# EAGLE design 002-main (EAGLE 9.6.2)

## Sheet 1 of 3
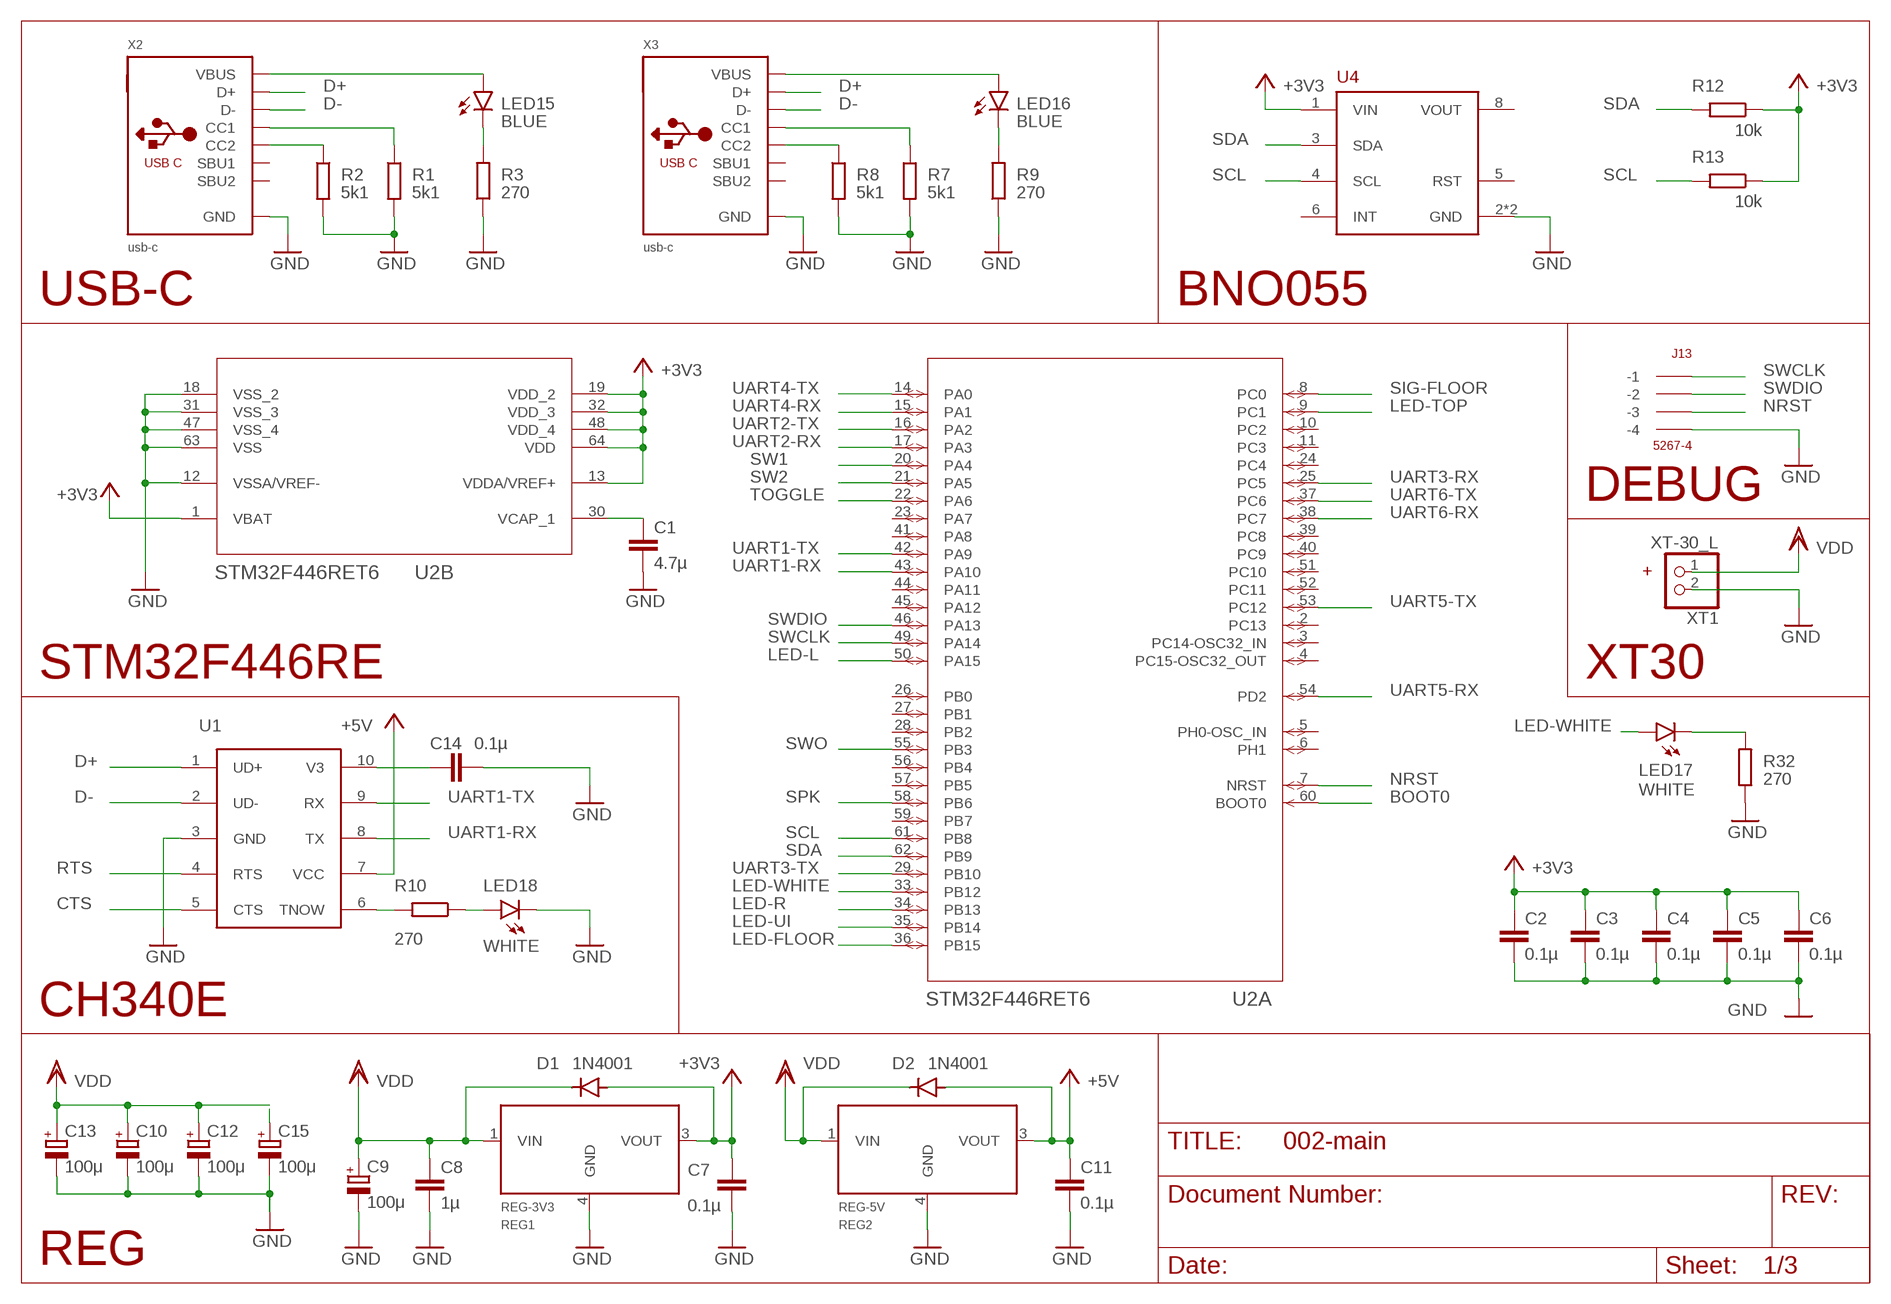
[diagram p0: schematic, sheet 1]

### Parts
C1  4.7µ  C-EUC0603  [C0603]
C2  0.1µ  C-EUC0603  [C0603]
C3  0.1µ  C-EUC0603  [C0603]
C4  0.1µ  C-EUC0603  [C0603]
C5  0.1µ  C-EUC0603  [C0603]
C6  0.1µ  C-EUC0603  [C0603]
C7  0.1µ  C-EUC0603  [C0603]
C8  1µ  C-EUC0603  [C0603]
C9  100μ  CPOL-EU153CLV-0505  [153CLV-0505]
C10  100μ  CPOL-EU153CLV-0505  [153CLV-0505]
C11  0.1µ  C-EUC0603  [C0603]
C12  100μ  CPOL-EU153CLV-0505  [153CLV-0505]
C13  100μ  CPOL-EU153CLV-0505  [153CLV-0505]
C14  0.1µ  C-EUC0603  [C0603]
C15  100μ  CPOL-EU153CLV-0505  [153CLV-0505]
D1  1N4001  GF1  [SMA-DO214AC]
D2  1N4001  GF1  [SMA-DO214AC]
J13  5267-4  [5267-4]
LED15  BLUE  LEDSML0603  [SML0603]
LED16  BLUE  LEDSML0603  [SML0603]
LED17  WHITE  LEDSML0603  [SML0603]
LED18  WHITE  LEDSML0603  [SML0603]
R1  5k1  R-EU_R0402  [R0402]
R2  5k1  R-EU_R0402  [R0402]
R3  270  R-EU_R0402  [R0402]
R7  5k1  R-EU_R0402  [R0402]
R8  5k1  R-EU_R0402  [R0402]
R9  270  R-EU_R0402  [R0402]
R10  270  R-EU_R0402  [R0402]
R12  10k  R-EU_R0402  [R0402]
R13  10k  R-EU_R0402  [R0402]
R32  270  R-EU_R0402  [R0402]
REG1  REG-3V3  MYPARTS_NJM7800S-REGULATOR  [MYPARTS_D-PAK_TO252AA]
REG2  REG-5V  MYPARTS_NJM7800S-REGULATOR  [MYPARTS_D-PAK_TO252AA]
U1  CH340ESMD  [MSOP10]
U2  STM32F446RET6  [LQFP64-10X10MM]
U4  BNO055  [SOCKET-08]
X2  usb-c  USB_C  [USB_C_CUSB31-CFM2AX-01-X]
X3  usb-c  USB_C  [USB_C_CUSB31-CFM2AX-01-X]
XT1  XT-30_L  [XT-30_L]

### Nets
+3V3: C2.1 C3.1 C4.1 C5.1 C6.1 C7.1 D1.A R12.1 R13.1 REG1.3(VOUT) U2.1(B:VBAT) U2.13(B:VDDA/VREF+) U2.19(B:VDD_2) U2.32(B:VDD_3) U2.48(B:VDD_4) U2.64(B:VDD) U4.1(VIN) ; also sheet 2,3
+5V: C11.1 D2.A REG2.3(VOUT) U1.7(VCC) ; also sheet 2,3
BOOT0: U2.60(A:BOOT0) ; also sheet 3
CTS: U1.5(CTS)
D+: U1.1(UD+) X2.A6(D+) X2.B6(D+) X3.A6(D+) X3.B6(D+)
D-: U1.2(UD-) X2.A7(D-) X2.B7(D-) X3.A7(D-) X3.B7(D-)
GND: C1.2 C2.2 C3.2 C4.2 C5.2 C6.2 C7.2 C8.2 C9.- C10.- C11.2 C12.- C13.- C14.2 C15.- J13.P$4(-4) LED18.C R1.2 R2.2 R3.1 R7.2 R8.2 R9.1 R32.1 REG1.4(GND) REG2.4(GND) U1.3(GND) U2.12(B:VSSA/VREF-) U2.18(B:VSS_2) U2.31(B:VSS_3) U2.47(B:VSS_4) U2.63(B:VSS) U4.2(GND) U4.7(GND) X2.A1B12(GND) X2.B1A12(GND) X3.A1B12(GND) X3.B1A12(GND) XT1.2 ; also sheet 2,3
LED-FLOOR: U2.36(A:PB15) ; also sheet 3
LED-L: U2.50(A:PA15) ; also sheet 2
LED-R: U2.34(A:PB13) ; also sheet 2
LED-TOP: U2.9(A:PC1) ; also sheet 2
LED-UI: U2.35(A:PB14) ; also sheet 3
LED-WHITE: LED17.A U2.33(A:PB12)
N$8: C14.1 U1.10(V3)
N$14: R1.1 X2.A5(CC1)
N$15: R2.1 X2.B5(CC2)
N$16: LED15.C R3.2
N$18: C1.1 U2.30(B:VCAP_1)
N$22: R10.2 U1.6(TNOW)
N$23: LED18.A R10.1
N$32: LED17.C R32.2
N$47: R7.1 X3.A5(CC1)
N$48: R8.1 X3.B5(CC2)
N$49: LED15.A X2.A4B9(VBUS) X2.B4A9(VBUS)
N$50: LED16.A X3.A4B9(VBUS) X3.B4A9(VBUS)
N$51: LED16.C R9.2
NRST: J13.P$3(-3) U2.7(A:NRST) ; also sheet 3
RTS: U1.4(RTS)
SCL: R13.2 U2.61(A:PB8) U4.4(SCL)
SDA: R12.2 U2.62(A:PB9) U4.3(SDA)
SIG-FLOOR: U2.8(A:PC0) ; also sheet 3
SPK: U2.58(A:PB6) ; also sheet 3
SW1: U2.20(A:PA4) ; also sheet 3
SW2: U2.21(A:PA5) ; also sheet 3
SWCLK: J13.P$1(-1) U2.49(A:PA14)
SWDIO: J13.P$2(-2) U2.46(A:PA13)
SWO: U2.55(A:PB3)
TOGGLE: U2.22(A:PA6) ; also sheet 3
UART1-RX: U1.8(TX) U2.43(A:PA10)
UART1-TX: U1.9(RX) U2.42(A:PA9)
UART2-RX: U2.17(A:PA3) ; also sheet 2
UART2-TX: U2.16(A:PA2) ; also sheet 2
UART3-RX: U2.25(A:PC5) ; also sheet 3
UART3-TX: U2.29(A:PB10) ; also sheet 3
UART4-RX: U2.15(A:PA1) ; also sheet 2
UART4-TX: U2.14(A:PA0) ; also sheet 2
UART5-RX: U2.54(A:PD2) ; also sheet 2
UART5-TX: U2.53(A:PC12) ; also sheet 2
UART6-RX: U2.38(A:PC7) ; also sheet 2
UART6-TX: U2.37(A:PC6) ; also sheet 2
VDD: C8.1 C9.+ C10.+ C12.+ C13.+ C15.+ D1.K(C) D2.K(C) REG1.1(VIN) REG2.1(VIN) XT1.1 ; also sheet 2
Unconnected: U2.2(A:PC13) U2.3(A:PC14-OSC32_IN) U2.4(A:PC15-OSC32_OUT) U2.5(A:PH0-OSC_IN) U2.6(A:PH1) U2.10(A:PC2) U2.11(A:PC3) U2.23(A:PA7) U2.24(A:PC4) U2.26(A:PB0) U2.27(A:PB1) U2.28(A:PB2) U2.39(A:PC8) U2.40(A:PC9) U2.41(A:PA8) U2.44(A:PA11) U2.45(A:PA12) U2.51(A:PC10) U2.52(A:PC11) U2.56(A:PB4) U2.57(A:PB5) U2.59(A:PB7) U4.5(RST) U4.6(INT) X2.A8(SBU1) X2.B8(SBU2) X3.A8(SBU1) X3.B8(SBU2)

### Notes on the sheet
- USB-C | BNO055
- DEBUG
- STM32F446RE | XT30
- CH340E
- REG

## Sheet 2 of 3
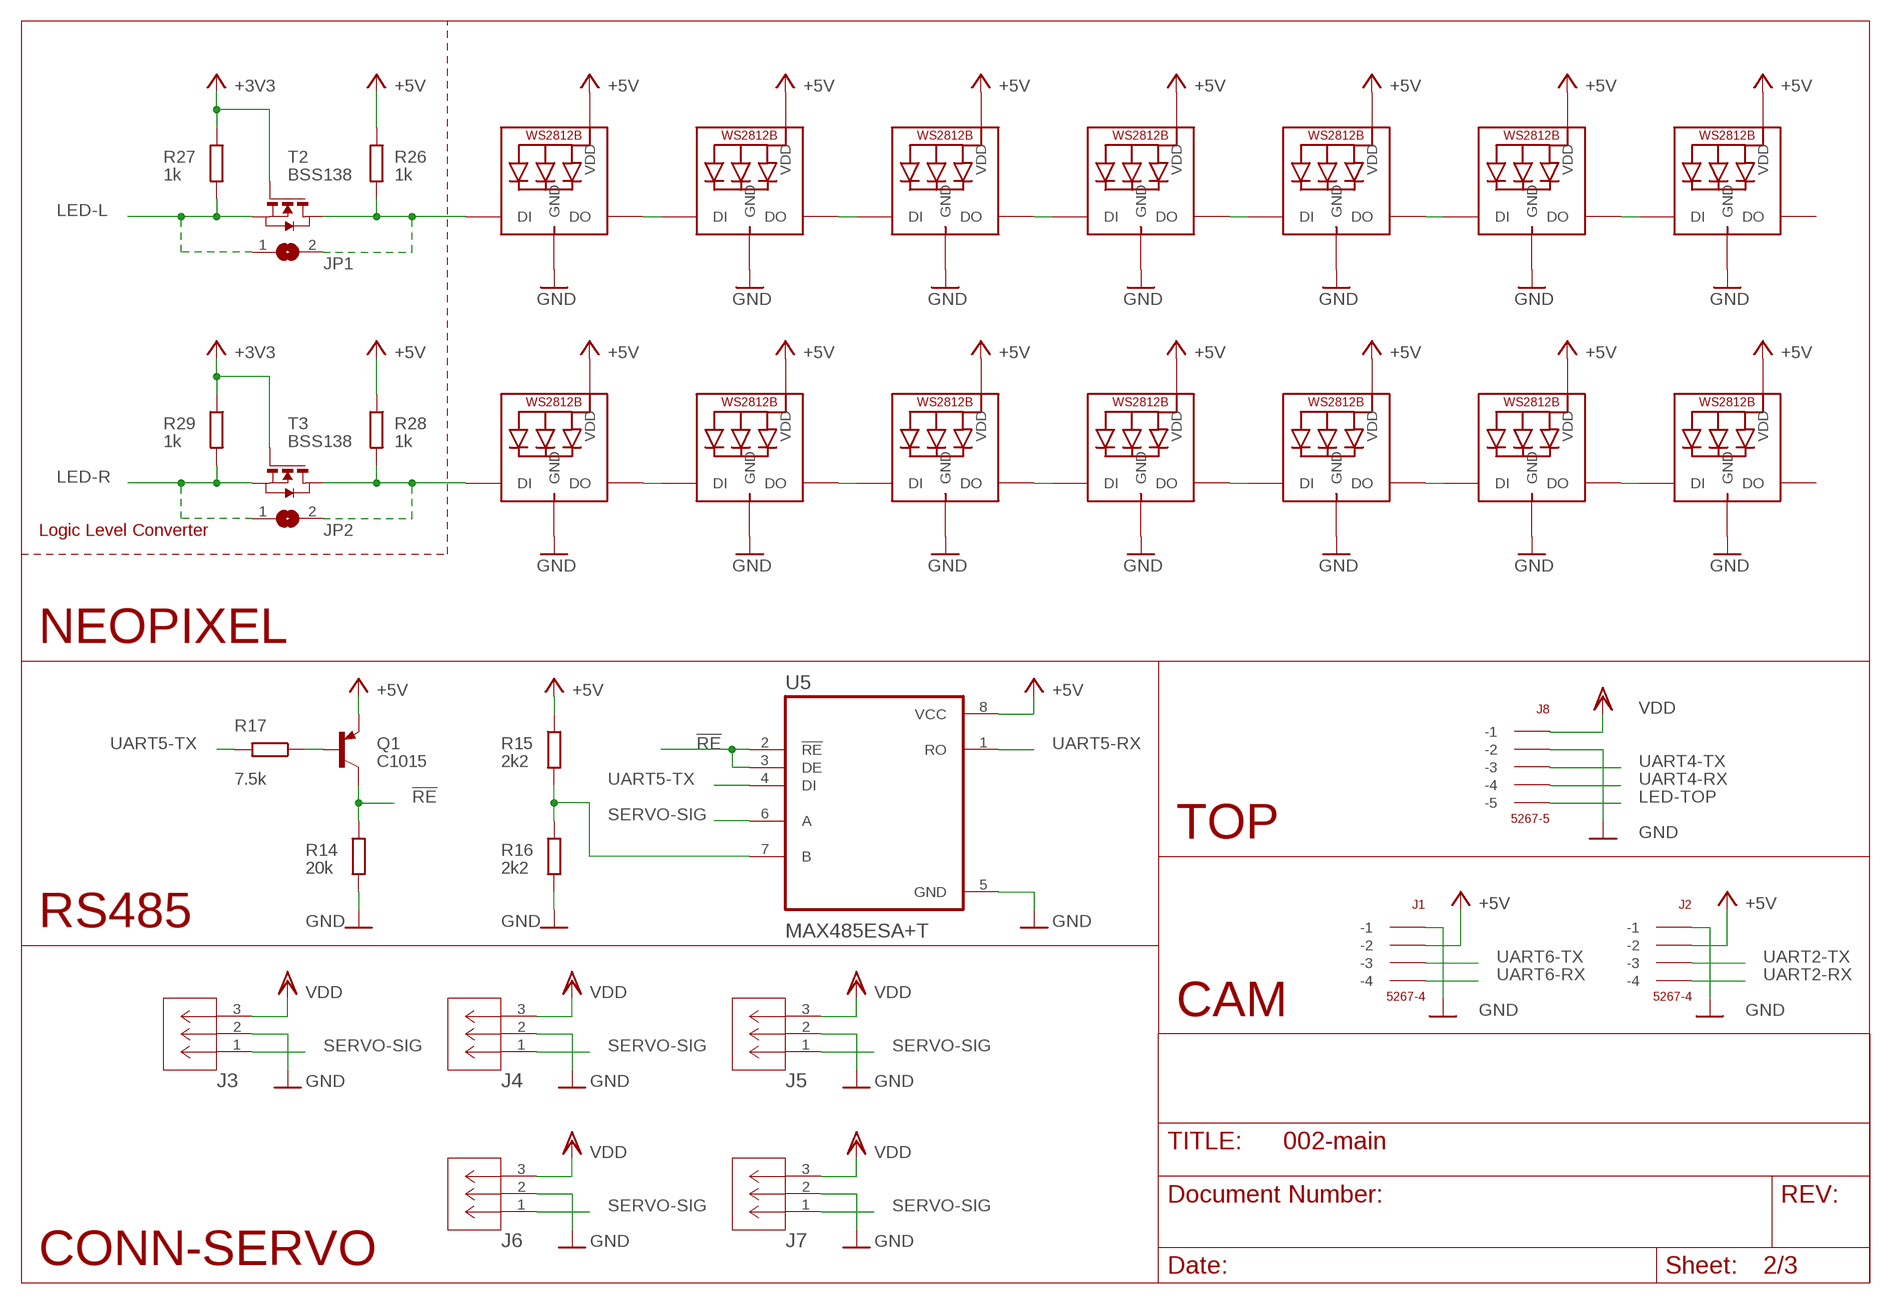
[diagram p1: schematic, sheet 2]

### Parts
J1  5267-4  [5267-4]
J2  5267-4  [5267-4]
J3  22057035  [CON_22057035_MOL]
J4  22057035  [CON_22057035_MOL]
J5  22057035  [CON_22057035_MOL]
J6  22057035  [CON_22057035_MOL]
J7  22057035  [CON_22057035_MOL]
J8  5267-5  [5267-5]
JP1  JP2  [JP2]
JP2  JP2  [JP2]
LED1  WS2812B_2020  [WS2812B_2020]
LED2  WS2812B_2020  [WS2812B_2020]
LED3  WS2812B_2020  [WS2812B_2020]
LED4  WS2812B_2020  [WS2812B_2020]
LED5  WS2812B_2020  [WS2812B_2020]
LED6  WS2812B_2020  [WS2812B_2020]
LED7  WS2812B_2020  [WS2812B_2020]
LED8  WS2812B_2020  [WS2812B_2020]
LED9  WS2812B_2020  [WS2812B_2020]
LED10  WS2812B_2020  [WS2812B_2020]
LED11  WS2812B_2020  [WS2812B_2020]
LED12  WS2812B_2020  [WS2812B_2020]
LED13  WS2812B_2020  [WS2812B_2020]
LED14  WS2812B_2020  [WS2812B_2020]
Q1  C1015  BCX71SMD  [SOT23]
R14  20k  R-EU_R0402  [R0402]
R15  2k2  R-EU_R0402  [R0402]
R16  2k2  R-EU_R0402  [R0402]
R17  7.5k  R-EU_R0402  [R0402]
R26  1k  R-EU_R0402  [R0402]
R27  1k  R-EU_R0402  [R0402]
R28  1k  R-EU_R0402  [R0402]
R29  1k  R-EU_R0402  [R0402]
T2  BSS138  NMOSSOT23  [SOT-23]
T3  BSS138  NMOSSOT23  [SOT-23]
U5  MAX485ESA+T  [SOIC127P600X175-8N]

### Nets
!RE: Q1.3(C) R14.1 U5.2(!RE) U5.3(DE)
+3V3: R27.1 R29.1 T2.3(G) T3.3(G) ; also sheet 1,3
+5V: J1.P$2(-2) J2.P$2(-2) LED1.4(VDD) LED2.4(VDD) LED3.4(VDD) LED4.4(VDD) LED5.4(VDD) LED6.4(VDD) LED7.4(VDD) LED8.4(VDD) LED9.4(VDD) LED10.4(VDD) LED11.4(VDD) LED12.4(VDD) LED13.4(VDD) LED14.4(VDD) Q1.2(E) R15.1 R26.1 R28.1 U5.8(VCC) ; also sheet 1,3
GND: J1.P$1(-1) J2.P$1(-1) J3.2 J4.2 J5.2 J6.2 J7.2 J8.P$2(-2) LED1.2(GND) LED2.2(GND) LED3.2(GND) LED4.2(GND) LED5.2(GND) LED6.2(GND) LED7.2(GND) LED8.2(GND) LED9.2(GND) LED10.2(GND) LED11.2(GND) LED12.2(GND) LED13.2(GND) LED14.2(GND) R14.2 R16.2 U5.5(GND) ; also sheet 1,3
LED-L: JP1.1 R27.2 T2.2(S) ; also sheet 1
LED-L-5V: JP1.2 LED1.3(DI) R26.2 T2.1(D)
LED-R: JP2.1 R29.2 T3.2(S) ; also sheet 1
LED-R-5V: JP2.2 LED8.3(DI) R28.2 T3.1(D)
LED-TOP: J8.P$5(-5) ; also sheet 1
N$1: LED1.1(DO) LED2.3(DI)
N$2: LED2.1(DO) LED3.3(DI)
N$3: LED3.1(DO) LED4.3(DI)
N$4: LED4.1(DO) LED5.3(DI)
N$5: LED5.1(DO) LED6.3(DI)
N$6: LED6.1(DO) LED7.3(DI)
N$7: LED8.1(DO) LED9.3(DI)
N$9: LED9.1(DO) LED10.3(DI)
N$10: LED10.1(DO) LED11.3(DI)
N$11: LED11.1(DO) LED12.3(DI)
N$12: LED12.1(DO) LED13.3(DI)
N$13: LED13.1(DO) LED14.3(DI)
N$27: Q1.1(B) R17.1
N$28: R15.2 R16.1 U5.7(B)
SERVO-SIG: J3.1 J4.1 J5.1 J6.1 J7.1 U5.6(A)
UART2-RX: J2.P$4(-4) ; also sheet 1
UART2-TX: J2.P$3(-3) ; also sheet 1
UART4-RX: J8.P$4(-4) ; also sheet 1
UART4-TX: J8.P$3(-3) ; also sheet 1
UART5-RX: U5.1(RO) ; also sheet 1
UART5-TX: R17.2 U5.4(DI) ; also sheet 1
UART6-RX: J1.P$4(-4) ; also sheet 1
UART6-TX: J1.P$3(-3) ; also sheet 1
VDD: J3.3 J4.3 J5.3 J6.3 J7.3 J8.P$1(-1) ; also sheet 1
Unconnected: LED7.1(DO) LED14.1(DO)

### Notes on the sheet
- Logic Level Converter
- NEOPIXEL
- TOP
- RS485
- CAM
- CONN-SERVO

## Sheet 3 of 3
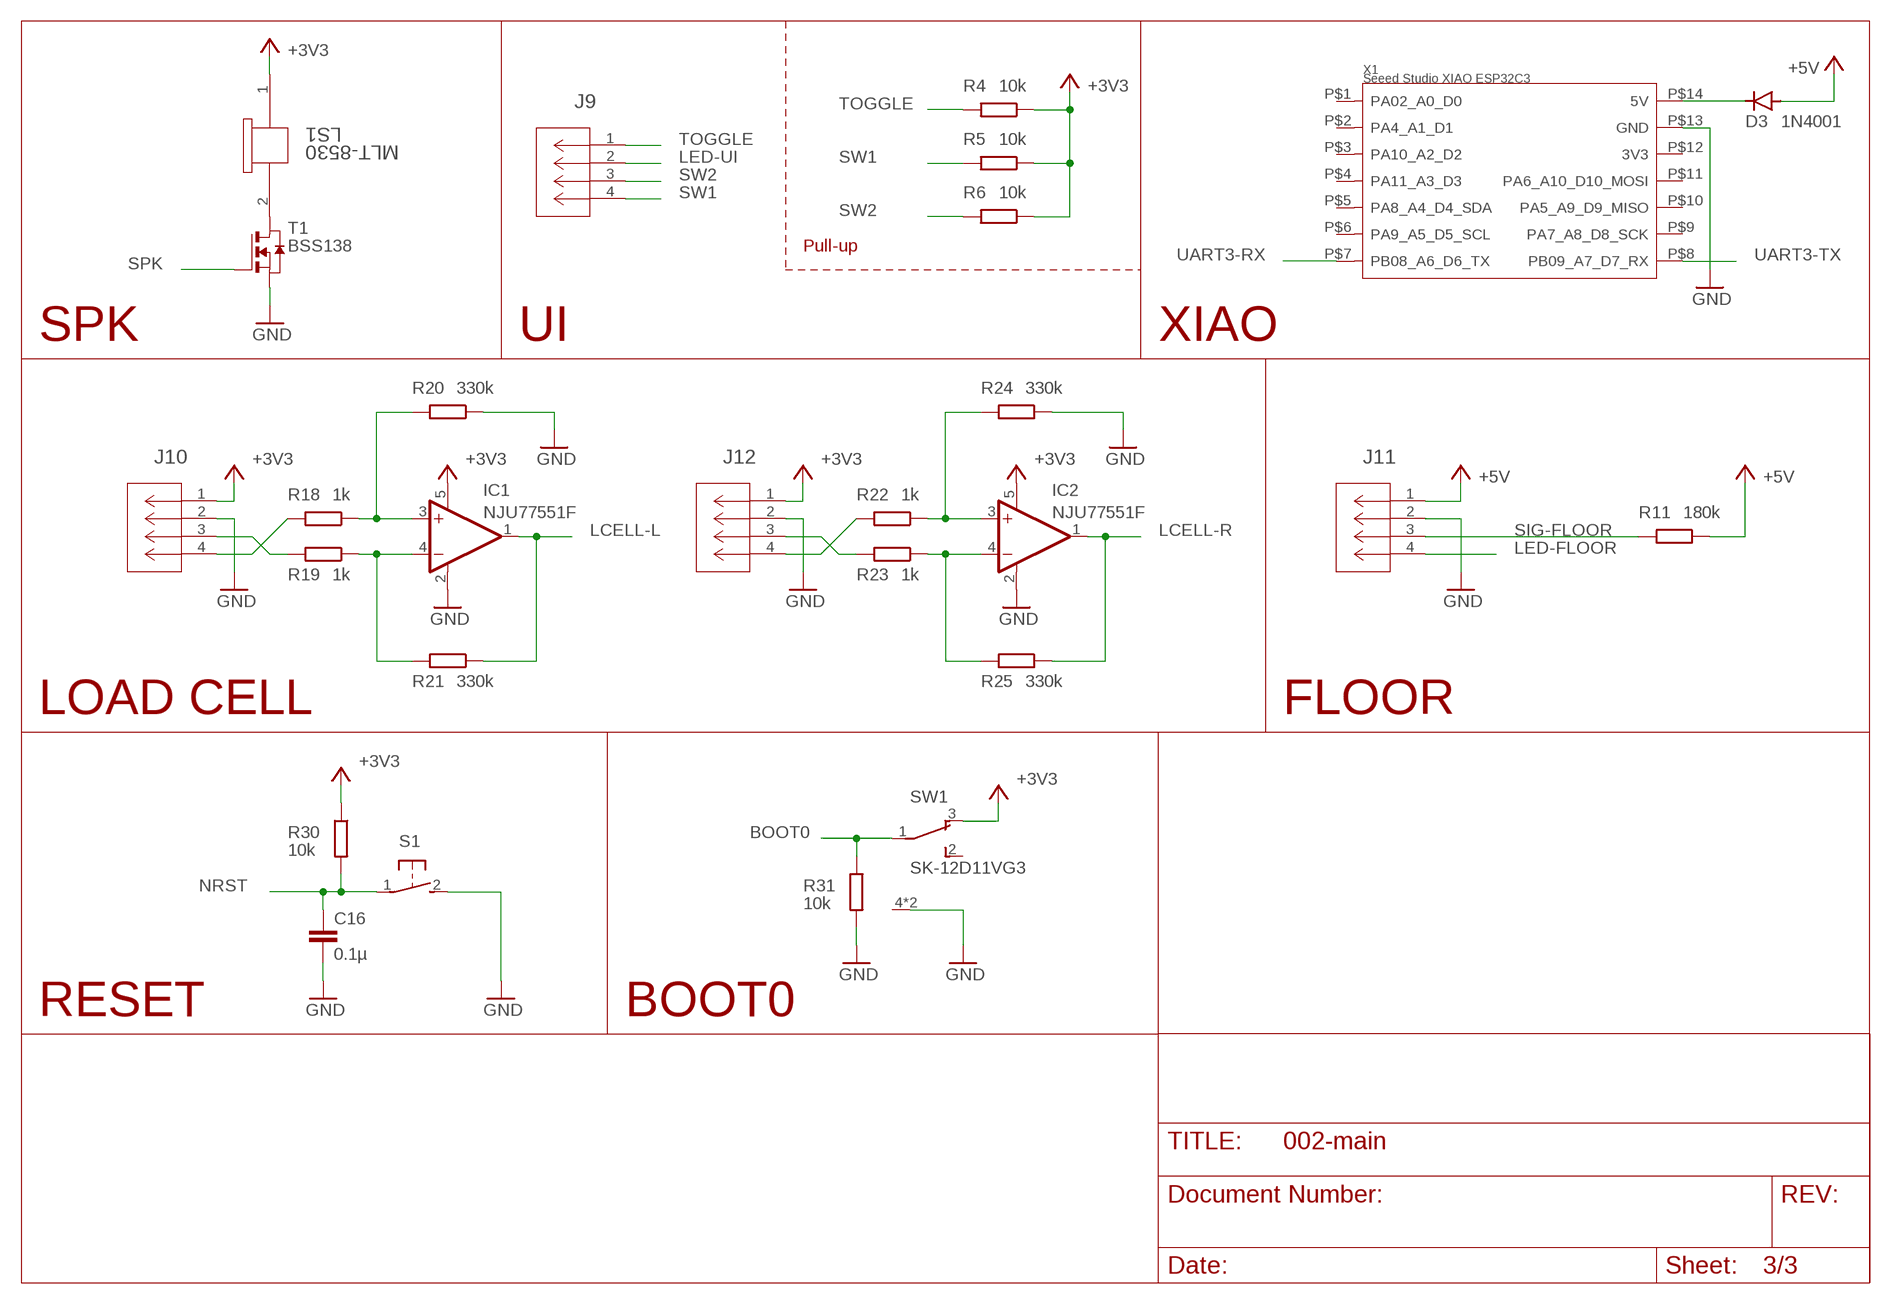
[diagram p2: schematic, sheet 3]

### Parts
C16  0.1µ  C-EUC0603  [C0603]
D3  1N4001  GF1  [SMA-DO214AC]
IC1  NJU77551F  OPA340N  [SOT23-5]
IC2  NJU77551F  OPA340N  [SOT23-5]
J9  22057045  [CON_22057045_MOL]
J10  22057045  [CON_22057045_MOL]
J11  22057045  [CON_22057045_MOL]
J12  22057045  [CON_22057045_MOL]
LS1  MLT-8530  [MLT-8530_JHE]
R4  10k  R-EU_R0402  [R0402]
R5  10k  R-EU_R0402  [R0402]
R6  10k  R-EU_R0402  [R0402]
R11  180k  R-EU_R0402  [R0402]
R18  1k  R-EU_R0402  [R0402]
R19  1k  R-EU_R0402  [R0402]
R20  330k  R-EU_R0402  [R0402]
R21  330k  R-EU_R0402  [R0402]
R22  1k  R-EU_R0402  [R0402]
R23  1k  R-EU_R0402  [R0402]
R24  330k  R-EU_R0402  [R0402]
R25  330k  R-EU_R0402  [R0402]
R30  10k  R-EU_R0402  [R0402]
R31  10k  R-EU_R0402  [R0402]
S1  31-XX  [B3F-31XX]
SW1  SK-12D11VG3  [SK-12D11VG3]
T1  BSS138  NMOSSOT23  [SOT-23]
X1  Seeed Studio XIAO ESP32C3  SEEEDUINO-XIAO-DIP  [XIAO-PINHEAD]

### Nets
+3V3: IC1.5(V+) IC2.5(V+) J10.1 J12.1 LS1.1 R4.1 R5.1 R6.1 R30.1 SW1.3(O) ; also sheet 1,2
+5V: D3.A J11.1 R11.1 ; also sheet 1,2
BOOT0: R31.1 SW1.1(P) ; also sheet 1
GND: C16.2 IC1.2(V-) IC2.2(V-) J10.2 J11.2 J12.2 R20.1 R24.1 R31.2 S1.2(S) SW1.4(CASE) SW1.5(CASE) T1.2(S) X1.P$13(GND) ; also sheet 1,2
LCELL-L: IC1.1(OUT) R21.1
LCELL-R: IC2.1(OUT) R25.1
LED-FLOOR: J11.4 ; also sheet 1
LED-UI: J9.2 ; also sheet 1
N$17: LS1.2 T1.1(D)
N$19: IC1.3(+IN) R18.1 R20.2
N$20: IC1.4(-IN) R19.1 R21.2
N$21: J10.3 R19.2
N$24: J10.4 R18.2
N$25: IC2.3(+IN) R22.1 R24.2
N$26: IC2.4(-IN) R23.1 R25.2
N$29: J12.4 R22.2
N$30: J12.3 R23.2
N$31: D3.K(C) X1.P$14(5V)
NRST: C16.1 R30.2 S1.1(P) ; also sheet 1
SIG-FLOOR: J11.3 R11.2 ; also sheet 1
SPK: T1.3(G) ; also sheet 1
SW1: J9.4 R5.2 ; also sheet 1
SW2: J9.3 R6.2 ; also sheet 1
TOGGLE: J9.1 R4.2 ; also sheet 1
UART3-RX: X1.P$7(PB08_A6_D6_TX) ; also sheet 1
UART3-TX: X1.P$8(PB09_A7_D7_RX) ; also sheet 1
Unconnected: SW1.2(S) X1.P$1(PA02_A0_D0) X1.P$2(PA4_A1_D1) X1.P$3(PA10_A2_D2) X1.P$4(PA11_A3_D3) X1.P$5(PA8_A4_D4_SDA) X1.P$6(PA9_A5_D5_SCL) X1.P$9(PA7_A8_D8_SCK) X1.P$10(PA5_A9_D9_MISO) X1.P$11(PA6_A10_D10_MOSI) X1.P$12(3V3)

### Notes on the sheet
- Pull-up
- SPK | UI | XIAO
- LOAD CELL | FLOOR
- RESET | BOOT0

## Power pins joined to a net without a drawn wire
VOUT: U4.8(VOUT)

## Library data of the parts
C1-C8 C11 C14 C16 = rcl:C-EU: CAPACITOR, European symbol; SPICEPREFIX: C
C9 C10 C12 C13 C15 = rcl:CPOL-EU: POLARIZED CAPACITOR, European symbol; SPICEPREFIX: C
D1-D3 = diode:GF1: DIODE
IC1 IC2 = burr-brown:OPA340: Rail-to-Rail Operational Amplifiers Single-Supply, MicroAmplifier(TM) Series; MPN: OPA340NA/3KG4; OC_FARNELL: 1234805; OC_NEWARK: 13M5177
J1 J2 J13 = con-molex-spox:5267-4
J3-J7 = con-molex-5268:22057035; COPYRIGHT: Copyright (C) 2022 Ultra Librarian. All rights reserved.; MANUFACTURER_PART_NUMBER: 22057035; MFR_NAME: Molex Connector Corporation
J8 = con-molex-spox:5267-5
J9-J12 = con-molex-5268:22057045; COPYRIGHT: Copyright (C) 2022 Ultra Librarian. All rights reserved.; MANUFACTURER_PART_NUMBER: 22057045; MFR_NAME: Molex Connector Corporation
JP1 JP2 = jp:JP2
LED1-LED14 = microbuilder:WS2812B
LED15-LED18 = led:LED: LED OSRAM: - CHIPLED LG R971, LG N971, LY N971, LG Q971, LY Q971, LO R971, LY R971 LH N974, LH R974 LS Q976, LO Q976, LY Q976 LO Q996 - Hyper CHIPLED LW Q18S LB Q993, LB Q99A, LB R99A - SideLED LS A670, LO A670, LY A670, LG A670, LP A670 LB A673, LV A673, LT A673, LW A673 LH A674 LY A675 LS A676, LA A676, LO A676, LY A676, LW A676 LS A679, LY A679, LG A679 - Hyper Micro SIDELED® LS Y876, LA Y876, LO Y876, LY Y876 LT Y87S - SmartLED LW L88C, LW L88S LB L89C, LB L89S, LG L890 LS L89K, LO L89K, LY L89K LS L896, LA L896, LO L896, LY L896 - TOPLED LS T670, LO T670, LY T670, LG T670, LP T670 LSG T670, LSP T670, LSY T670, LOP T670, LYG T670 LG T671, LOG T671, LSG T671 LB T673, LV T673, LT T673, LW T673 LH T674 LS T676, LA T676, LO T676, LY T676, LB T676, LH T676, LSB T676, LW T676 LB T67C, LV T67C, LT T67C, LS T67K, LO T67K, LY T67K, LW E67C LS E67B, LA E67B, LO E67B, LY E67B, LB E67C, LV E67C, LT E67C LW T67C LS T679, LY T679, LG T679 LS T770, LO T770, LY T770, LG T770, LP T770 LB T773, LV T773, LT T773, LW T773 LH T774 LS E675, LA E675, LY E675, LS T675 LS T776, LA T776, LO T776, LY T776, LB T776 LHGB T686 LT T68C, LB T68C - Hyper Mini TOPLED® LB M676 - Mini TOPLED Santana® LG M470 LS M47K, LO M47K, LY M47K Source: http://www.osram.convergy.de LUXEON: - LUMILED® LXK2-PW12-R00, LXK2-PW12-S00, LXK2-PW14-U00, LXK2-PW14-V00 LXK2-PM12-R00, LXK2-PM12-S00, LXK2-PM14-U00 LXK2-PE12-Q00, LXK2-PE12-R00, LXK2-PE12-S00, LXK2-PE14-T00, LXK2-PE14-U00 LXK2-PB12-K00, LXK2-PB12-L00, LXK2-PB12-M00, LXK2-PB14-N00, LXK2-PB14-P00, LXK2-PB14-Q00 LXK2-PR12-L00, LXK2-PR12-M00, LXK2-PR14-Q00, LXK2-PR14-R00 LXK2-PD12-Q00, LXK2-PD12-R00, LXK2-PD12-S00 LXK2-PH12-R00, LXK2-PH12-S00 LXK2-PL12-P00, LXK2-PL12-Q00, LXK2-PL12-R00 Source: www.luxeon.com KINGBRIGHT: KA-3528ASYC Source: www.kingbright.com
LS1 = MLT-8530:MLT-8530; COPYRIGHT: Copyright (C) 2022 Ultra Librarian. All rights reserved.; MANUFACTURER_PART_NUMBER: MLT-8530; MFR_NAME: Jiangsu Huaneng Elec
Q1 = transistor-pnp:BCX71SMD: PNP Transistor
R1-R32 = rcl:R-EU_: RESISTOR, European symbol; SPICEPREFIX: R
REG1 REG2 = #001-line:MYPARTS_NJM7800S-REGULATOR
S1 = switch-omron:31-XX: OMRON SWITCH; MPN: B3F-3100; OC_FARNELL: 959704; OC_NEWARK: 36M3582
SW1 = Slide Switch:SK-12D11VG3
T1-T3 = zetex:NMOSSOT23: MOS FET; OC_FARNELL: unknown; OC_NEWARK: unknown
U1 = CH340E:CH340E: WCH.CN/CH340E See DataSheet： wch.cn <http://www.wch.cn/downloads/CH340DS1_PDF.html>
U2 = F446RE:STM32F446RET6; COPYRIGHT: Copyright (C) 2022 Ultra Librarian. All rights reserved.; MANUFACTURER_PART_NUMBER: STM32F446RET6; MFR_NAME: STMicroelectronics
U4 = BNO055:BNO055
U5 = MAX485:MAX485ESA+T: Check availability <https://pricing.snapeda.com/parts/MAX485ESA/Maxim%20Integrated/view-part?ref=eda>; AVAILABILITY: In Stock; DESCRIPTION: 1/1 Transceiver Half RS422, RS485 8-SOIC; MF: Maxim Integrated; MP: MAX485ESA; PACKAGE: SOIC-8 Maxim; PRICE: None; PURCHASE-URL: https://pricing.snapeda.com/search/part/MAX485ESA/?ref=eda
X1 = Seeeduino XIAO:SEEEDUINO-XIAO-DIP
X2 X3 = microbuilder:USB_C: USB Type-C USB 2.0 Connector
XT1 = XT-30:XT-30_L

## Net classes
0 default: width 0.127 mm

## Board
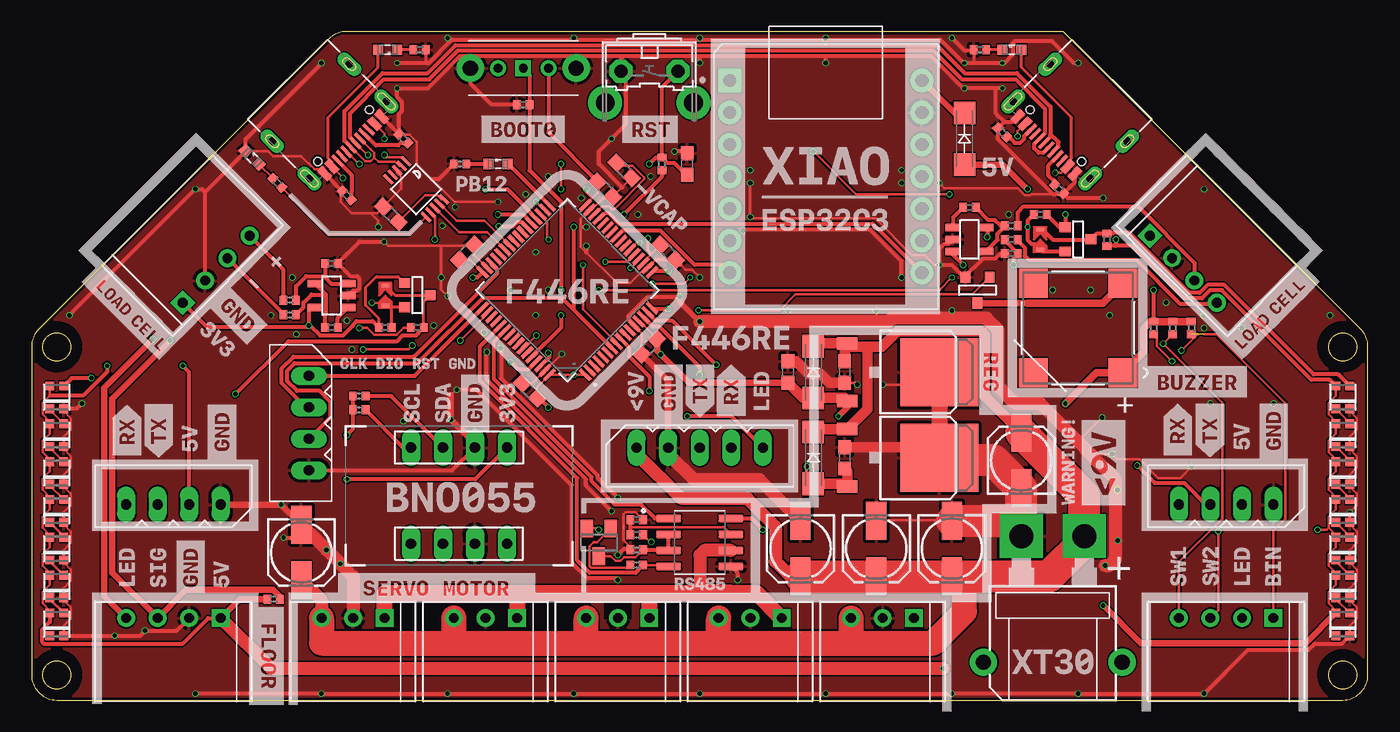
[diagram p3: board, top side]
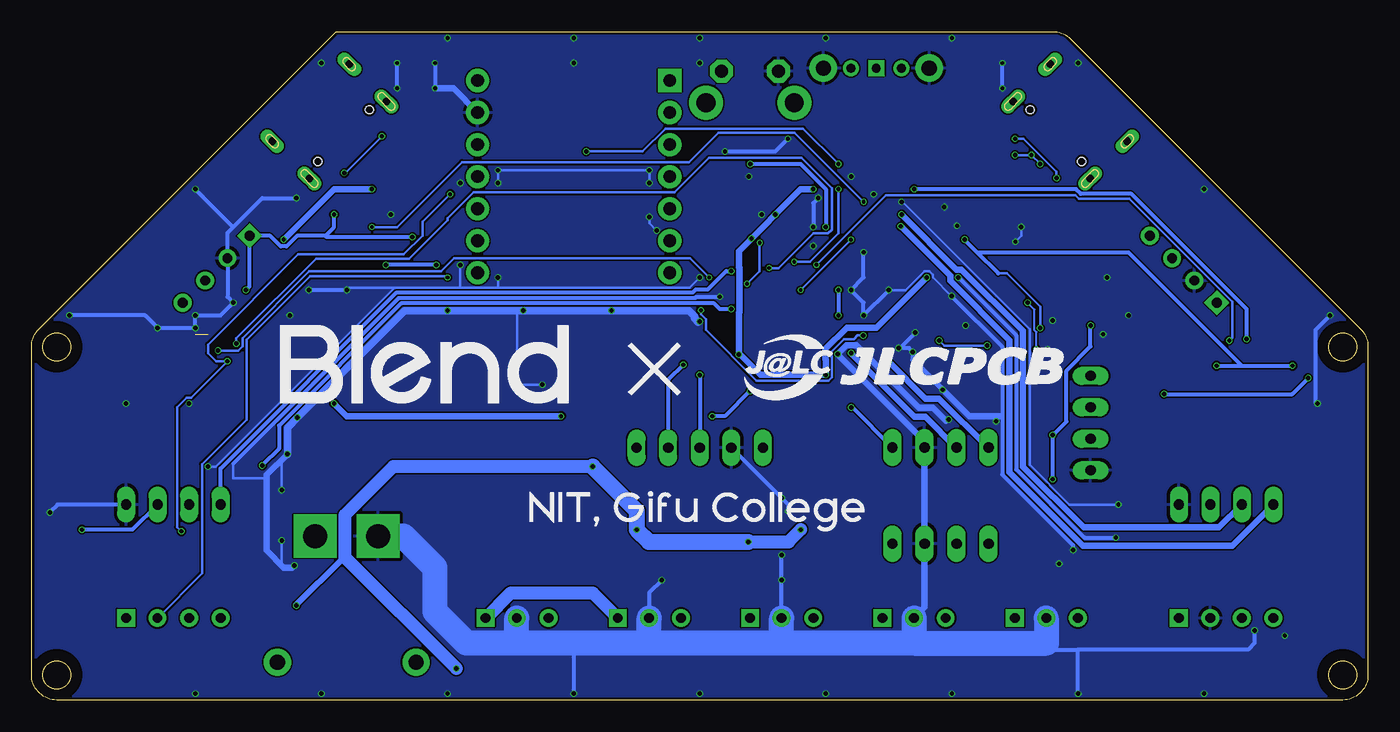
[diagram p4: board, bottom side, seen from below]

Size 106 x 53 mm. Coordinates in mm from the lower left corner, seen from the top.
Outline: 32.41,0 72.59,0
Outline: 25,53 arc45 23.59,52.41 0.59,29.41 arc45 0,28 0,2 arc90 2,0 104,0 arc90 106,2 106,28 arc45 105.41,29.41 81.83,53 25,53
Outline: circle at 2,2 radius 1.1
Outline: circle at 104,2 radius 1.1
Outline: circle at 104,28 radius 1.1
Outline: circle at 2,28 radius 1.1
Copper layers (1*16): Top 0.035mm / dielectric 1.6mm / Bottom 0.035mm
Design rules "jlcpcb-2layers": minimum track width 5mil, minimum drill 0.3mm, track to track 5mil, track to pad 5mil, pad to pad 5mil, via to via 5mil, smd to smd 5mil, copper to edge 0.2mm, drill to drill 6mil, minimum pad ring 10mil, minimum via ring 3mil, stop-mask expansion 4mil, vias tented up to drill 0mil, thermal gap 10mil
tRestrict: area 0,26 to 4,30; area 0,0 to 4,4; area 102,0 to 106,4; area 102,26 to 106,30; area 35,6 to 37,7.5; area 45.5,6.5 to 47.5,7.5; area 56,6 to 58,7.5
bRestrict: area 0,26 to 4,30; area 0,0 to 4,4; area 102,0 to 106,4; area 102,26 to 106,30

### Footprints (pad centres in the part's own frame; a part is rotated, then mirrored left to right if it is on the bottom)
C0603 = smd 1.1 x 1: 1 -0.85,0; 2 0.85,0
153CLV-0505 = smd 3 x 1.6: + 2.2,0; - -2.2,0
SMA-DO214AC = smd 1.8 x 1.7: A -2.05,0; K 2.05,0
SOT23-5 = smd 0.6 x 1.2: 1 -0.95,-1.306; 2 0,-1.306; 3 0.95,-1.306; 4 0.95,1.306; 5 -0.95,1.306
5267-4 = drill 0.8 long: P$1 0,0; P$2 2.5,0; P$3 5,0; P$4 7.5,0
CON_22057035_MOL = drill 0.787 pad 1.143 square: 1 0,0 | drill 0.787 pad 1.143: 2 -2.489,0; 3 -5.004,0
5267-5 = drill 0.8 long: P$1 0,0; P$2 2.5,0; P$3 5,0; P$4 7.5,0; P$5 10,0
CON_22057045_MOL = drill 0.787 pad 1.143 square: 1 0,0 | drill 0.787 pad 1.143: 2 -2.489,0; 3 -5.004,0; 4 -7.493,0
JP2 = smd 0.305 x 0.61: 1 -0.8,0; 2 0.8,0
WS2812B_2020 = smd 0.7 x 0.7: 1 0.9,-0.55; 2 0.9,0.55; 3 -0.9,0.55; 4 -0.9,-0.55
SML0603 = smd 0.8 x 0.8: A 0.75,0; C -0.75,0
MLT-8530_JHE = smd 2.311 x 2.311: 1 -3.55,3.55; 2 -3.55,-3.55; 3 3.55,3.55; 4 3.55,-3.55
SOT23 = smd 1 x 1.4: 1 -0.95,-1.1; 2 0.95,-1.1; 3 0,1.1
R0402 = smd 0.6 x 0.7: 1 -0.5,0; 2 0.5,0
MYPARTS_D-PAK_TO252AA = smd 1 x 1.6: 1 -2.28,-4.8; 3 2.28,-4.8 | smd 5.4 x 6.2: 4 0,2.5
B3F-31XX = drill 1.016 octagon: 1 -2.261,-1.245; 2 2.261,-1.245 | drill 1.499 pad 2.159: 3 -3.505,1.245; 4 3.505,1.245
SK-12D11VG3 = drill 0.7 square: 1 0,0 | drill 0.7: 2 -2,0; 3 2,0 | drill 1.2: 4 -4.2,0; 5 4.2,0
SOT-23 = smd 0.787 x 0.889: 1 0.025,-1.016; 2 -0.94,1.016; 3 0.991,1.016
MSOP10 = smd 1 x 0.25: 1 -2.113,1; 2 -2.113,0.5; 3 -2.113,0; 4 -2.113,-0.5; 5 -2.113,-1; 6 2.113,-1; 7 2.113,-0.5; 8 2.113,0; 9 2.113,0.5; 10 2.113,1
LQFP64-10X10MM = smd 1.194 x 0.305: 1 -5.75,3.75; 2 -5.75,3.25; 3 -5.75,2.75; 4 -5.75,2.25; 5 -5.75,1.75; 6 -5.75,1.25; 7 -5.75,0.75; 8 -5.75,0.25; 9 -5.75,-0.25; 10 -5.75,-0.75; 11 -5.75,-1.25; 12 -5.75,-1.75; 13 -5.75,-2.25; 14 -5.75,-2.75; 15 -5.75,-3.25; 16 -5.75,-3.75; 33 5.75,-3.75; 34 5.75,-3.25; 35 5.75,-2.75; 36 5.75,-2.25; 37 5.75,-1.75; 38 5.75,-1.25; 39 5.75,-0.75; 40 5.75,-0.25; 41 5.75,0.25; 42 5.75,0.75; 43 5.75,1.25; 44 5.75,1.75; 45 5.75,2.25; 46 5.75,2.75; 47 5.75,3.25; 48 5.75,3.75 | smd 0.305 x 1.194: 17 -3.75,-5.75; 18 -3.25,-5.75; 19 -2.75,-5.75; 20 -2.25,-5.75; 21 -1.75,-5.75; 22 -1.25,-5.75; 23 -0.75,-5.75; 24 -0.25,-5.75; 25 0.25,-5.75; 26 0.75,-5.75; 27 1.25,-5.75; 28 1.75,-5.75; 29 2.25,-5.75; 30 2.75,-5.75; 31 3.25,-5.75; 32 3.75,-5.75; 49 3.75,5.75; 50 3.25,5.75; 51 2.75,5.75; 52 2.25,5.75; 53 1.75,5.75; 54 1.25,5.75; 55 0.75,5.75; 56 0.25,5.75; 57 -0.25,5.75; 58 -0.75,5.75; 59 -1.25,5.75; 60 -1.75,5.75; 61 -2.25,5.75; 62 -2.75,5.75; 63 -3.25,5.75; 64 -3.75,5.75
SOCKET-08 = drill 0.813 long: 1 -3.81,-3.81; 2 -1.27,-3.81; 3 1.27,-3.81; 4 3.81,-3.81; 5 3.81,3.81; 6 1.27,3.81; 7 -1.27,3.81; 8 -3.81,3.81
SOIC127P600X175-8N = smd 1.97 x 0.59: 1 -2.475,1.905; 2 -2.475,0.635; 3 -2.475,-0.635; 4 -2.475,-1.905; 5 2.475,-1.905; 6 2.475,-0.635; 7 2.475,0.635; 8 2.475,1.905
XIAO-PINHEAD = drill 1.016 square: P$1 -7.62,7.62 | drill 1.016: P$2 -7.62,5.08; P$3 -7.62,2.54; P$4 -7.62,0; P$5 -7.62,-2.54; P$6 -7.62,-5.08; P$7 -7.62,-7.62; P$8 7.62,-7.62; P$9 7.62,-5.08; P$10 7.62,-2.54; P$11 7.62,0; P$12 7.62,2.54; P$13 7.62,5.08; P$14 7.62,7.62
USB_C_CUSB31-CFM2AX-01-X = smd 0.575 x 1.15: A1B12 -3.2,3.545; A4B9 -2.4,3.545; B1A12 3.2,3.545; B4A9 2.4,3.545 | smd 0.275 x 1.15: A5 -1.25,3.545; A6 -0.25,3.545; A7 0.25,3.545; A8 1.25,3.545; B5 1.75,3.545; B6 0.75,3.545; B7 -0.75,3.545; B8 -1.75,3.545 | drill 0.6 pad 1 long: M1 -4.32,2.97; M2 4.32,2.97; M3 -4.32,-1.21; M4 4.32,-1.21 | hole 0.65: 2.89,2.47; -2.89,2.47
XT-30_L = drill 1.9 square: 1 3,-10; 2 8,-10 | drill 1.2: P$1 0,0; P$2 11,0

### Placement (x,y rotation side)
C1  47,42 315 top
C2  39.5,24.5 135 top
C3  45.5,40.5 315 top
C4  34.5,35.5 45 top
C5  50.5,35.5 315 top
C6  49,28 225 top
C7  60,26 90 top
C8  64.5,26 270 top
C9  78.5,19 90 top
C10  73,12 270 top
C11  64.5,19.2 90 top
C12  67,12 270 top
C13  61,12 270 top
C14  28.5,38.5 135 top
C15  21.4,11.7 270 top
C16  52,42.5 90 top
D1  62,26 90 top
D2  62,19.2 90 top
D3  74,44.5 90 top
IC1  74.4,36.52 270 top
IC2  23.79,32.07 90 top
J1  15,15.5 180 top
J2  98.5,15.5 180 top
J3  28,6.5 0 top
J4  38.5,6.5 0 top
J5  49,6.5 0 top
J6  59.5,6.5 0 top
J7  70,6.5 0 top
J8  48,20 0 top
J9  98.5,6.5 0 top
J10  88.7,36.8 135 top
J11  15,6.5 0 top
J12  12,31.5 225 top
J13  22,25.7 270 top
JP1  28.06,32.07 90 top
JP2  80,36.5 90 top
LED1  2,24 270 top
LED2  2,21 270 top
LED3  2,18 270 top
LED4  2,15 270 top
LED5  2,12 270 top
LED6  2,9 270 top
LED7  2,6 270 top
LED8  104,24 270 top
LED9  104,21 270 top
LED10  104,18 270 top
LED11  104,15 270 top
LED12  104,12 270 top
LED13  104,9 270 top
LED14  104,6 270 top
LED15  77.77,51.55 0 top
LED16  28.23,51.55 180 top
LED17  37,42.5 0 top
LED18  17.5,43 315 top
LS1  83,29.5 180 top
Q1  45,12.5 180 top
R1  81.5,40.5 315 top
R2  77,45 135 top
R3  75.22,51.55 0 top
R4  92,29.5 270 top
R5  90.5,29.5 270 top
R6  89,29.5 270 top
R7  29.5,44.5 135 top
R8  25,40 135 top
R9  30.77,51.55 180 top
R10  19.5,41 315 top
R11  19.2,8 0 top
R12  26,24.1 0 top
R13  26,23 0 top
R14  48,11.9 180 top
R15  48,13.1 180 top
R16  48,14.3 0 top
R17  48,10.7 0 top
R18  77.7,36.5 0 top
R19  77.7,37.6 0 top
R20  77.7,35.4 0 top
R21  74.4,39.06 0 top
R22  20.48,31.7 180 top
R23  20.48,30.53 180 top
R24  23.79,34.61 180 top
R25  23.79,29.53 180 top
R26  30.6,29.53 0 top
R27  28.06,29.53 0 top
R28  85.3,36.5 90 top
R29  80,38.5 180 top
R30  50,42.5 90 top
R31  39,47.2 180 top
R32  34,42.5 0 top
REG1  69.5,26 270 top
REG2  69.5,19.2 270 top
S1  49.01,48.61 180 top
SW1  39,50.1 0 top
T1  75,32.5 0 top
T2  30.6,32.07 90 top
T3  83,36.5 90 top
U1  30.5,40.5 315 top
U2  42.5,32.5 135 top
U4  33.9,16.2 180 top
U5  53,12.5 0 top
X1  63,41.5 0 top
X2  83,46.5 135 top
X3  23,46.5 225 top
XT1  86.5,3 180 top

### Tracks (layer width: path | path; a pad name or v marks a point on that pad's centre or on a via)
!RE
  Top 0.2: Q1.3 45.92,11.4 46.3,11.02 46.7,11.02 47,11.32 47.92,11.32 R14.1
  Top 0.305: U5.2 U5.3 50.49,11.9 R14.1
+3V3  (via drill 0.35)
  Top 0.203: C6.1 49.6,28.65 48.23,30.02 U2.13 | C5.1 49.15,35.35 48.51,34.71 U2.19 | U2.32 44.47,39.78 | 44.47,39.78 44.9,40.2 C3.1 | C2.1 40.1,24.8 U2.64 | U2.64 v43,25.78 U2.1 | U2.64 41.28,25.97 41.25,26 U2.64 | R4.1 R6.1 | U2.48 34.8,34.9 C4.1 | 44.47,39.78 44,40.25 v44,40.5 | R5.1 88.74,30
  Top 0.254: 49.15,35.35 48.9,35.6 v48.9,36.6 | R27.1 27.56,30.23 26.5,31.29 26.5,32.72 27.35,33.58 29.07,33.58 T2.3
  Top 0.305: R12.1 R13.1 25.5,21.5 v25,21 | U4.1 35.2,17.5 v25,17.5 | R6.1 v89,32.5 | IC2.5 22,31.12 v22,29.7 | v22,29.7 22,29.61 13.89,29.61 J12.1 | U2.48 35.37,33.5 v35,33.5 | R29.1 81.51,37.49 T3.3 82,37.51 v82,38.5 | IC1.5 75.8,37.38 v75.8,36.7 | v22,29.7 22.07,29.7 22.87,28.9 24.71,28.9 25.47,29.66 25.47,29.72 25.78,30.03 27.04,30.03 27.54,29.53 R27.1 | C2.1 40.3,23.9 v41,23.2 | SW1.3 41,45 C3.1 | R30.1 50,41.5 v47,38.5
  Top 0.508: C6.1 49.6,27.7 v49.9,27.4 52.15,25.15 C7.1 | REG1.3 64.7,23.2 v64,22.5
  Top 0.61: v82,23.5 84.45,25.95 LS1.1 88.22,27.62 88.22,29.48 88.74,30 R4.1
  Top 0.813: C7.1 61.2,23.95 D1.A 64.47,23.95 REG1.3
  Bottom 0.254: v48.9,36.6 v47,38.5 45,40.5
  Bottom 0.305: v25,17.5 v25,21 23.92,22.08 23.92,26.11 22,28.03 v22,29.7 | v89,32.5 88.7,32.8 J10.1 87.05,36.8 86.22,35.97 85.78,35.97 84.95,36.8 82.68,36.8 | 82.68,36.8 82,37.48 v82,38.5 | U4.1 40.9,23.2 v41,23.2 | v48.9,36.6 49.9,35.6 49.9,27.5 v49.9,27.4 | v75.8,36.7 82.58,36.7 82.68,36.8
  Bottom 0.508: v64,22.5 81,22.5 v82,23.5 | 49.9,27.5 48.18,25.78 v43,25.78 43,27 43.03,27.03 43.03,27.83 41.33,29.53 38.97,29.53 v35,33.5 | v49.9,27.4 49.9,30.7 49.87,30.74 49.87,34.26 49.9,34.3 49.9,35.6 45,40.5 v44,40.5
+5V  (via drill 0.35)
  Top 0.2: Q1.2 44.9,13.6 v45,13.5
  Top 0.203: LED1.4 1.45,24.12 0.87,23.55 0.87,22.66 1.45,22.08 LED2.4 1.45,21.12 0.87,20.55 0.87,19.66 1.45,19.08 LED3.4 1.45,18.12 0.87,17.55 0.87,16.66 1.45,16.08 LED4.4 1.45,15.12 0.87,14.55 0.87,13.66 1.45,13.08 LED5.4 1.45,12.12 0.87,11.55 0.87,10.66 1.45,10.08 LED6.4 1.45,9.12 0.87,8.55 0.87,7.65 1.45,7.08 LED7.4 | LED14.4 103.45,7.08 102.87,7.65 102.87,8.55 103.45,9.12 LED13.4 103.45,10.08 102.87,10.66 102.87,11.55 103.45,12.12 LED12.4 103.45,13.08 102.87,13.66 | 102.87,13.66 102.87,14.55 103.45,15.12 LED11.4 103.45,16.08 102.87,16.66 102.87,17.55 103.45,18.12 LED10.4 103.45,19.08 102.87,19.66 102.87,20.55 103.45,21.12 LED9.4 103.45,22.08 102.87,22.66 102.87,23.55 103.45,24.12 LED8.4 | U1.7 32,38.29 v32,36.5 | D2.A 61.5,17.65 v61.5,18.5 | R15.1 49.06,12.54 v49.14,12.54 | R26.1 30.07,29.5 29.5,29.5 28.95,28.95 27.16,28.95 26.62,29.5 v26,29.5 | v102,13.5 102.72,13.5 102.87,13.66
  Top 0.305: U5.8 57.09,14.41 v58,13.5 | LED7.4 1.45,6.2 0.82,5.57 0.82,4.63 0.98,4.47 11.97,4.47 14,6.5 J11.1 | LED8.4 102.96,25.39 101.51,25.39 94.41,32.49 93.47,32.49 92.83,31.84 91.45,31.84 87.29,36 86,36 | 86,36 R28.1 | v86,36.5 86,36 | v6,26.5 6,26.03 4.09,24.12 1.45,24.12 | J1.P$2 12.5,26 v12,26.5
  Top 0.508: v85,7.5 88,4.5 101.05,4.5 LED14.4 | D3.A 77.05,42.45 v79,40.5 | J11.1 16.5,8 R11.1
  Top 0.813: D2.A 64.47,17.15 REG2.3 64.7,18.15 C11.1
  Top 1.016: J11.1 19,2.5 v72.32,2.5
  Bottom 0.203: 29.33,33.83 28.65,33.83 26,31.18 v26,29.5
  Bottom 0.305: 31,35.5 19,35.5 10,26.5 | 31,35.5 v32,36.5 | 81.41,11.5 81.32,11.5 81.16,11.34 | 29.33,33.83 31,35.5 | 10,26.5 v6,26.5 | v12,26.5 10,26.5 | J2.P$2 98,13.5 v102,13.5
  Bottom 0.508: 81.41,11.5 81.41,11.13 85,7.54 v85,7.5 | v79,40.5 82,40.5 v86,36.5
  Bottom 1.016: v49.14,12.54 45.96,12.54 v45,13.5 | v61.5,18.5 77.32,18.5 81.16,14.66 81.16,11.34 v72.32,2.5
  Bottom 1.27: v61.5,18.5 58,15 v58,13.5 57.04,12.54 v49.14,12.54
BOOT0  (via drill 0.35)
  Top 0.305: SW1.1 39.5,49.6 R31.1 39.5,42 42,39.5 v42,32.5 | v42,30.5 42,29.52 U2.60
  Bottom 0.305: v42,32.5 v42,30.5
D+  (via drill 0.35)
  Top 0.203: X3.A6 26.65,43.2 v26.7,43.2 | v26,42.5 25.94,42.5 X3.B6 | v28,43.2 28.18,43.02 29.4,43.02 U1.1
  Top 0.305: X2.A6 80.24,43.39 79.89,43.39 79.53,43.74 79.53,44.09 X2.B6 80.39,44.95 80.39,46.87 78.06,49.21 73.79,49.21 71.5,51.5 33.83,51.5 31.54,49.21 27.94,49.21 25.25,46.52 25.25,44.6 X3.A6
  Bottom 0.203: v26,42.5 v26.7,43.2 v28,43.2
D-
  Top 0.203: X3.A7 25.36,43.82 26.46,42.72 26.9,42.72 27.18,43 | 27.18,43 27.18,43.4 26.9,43.68 26.88,43.68 X3.B7 | U1.2 29.15,42.35 28.84,42.66 27.52,42.66 27.18,43
  Top 0.305: 80.82,44.87 80.82,44.67 X2.A7 | 80.82,44.87 81.45,44.24 81.45,43.89 X2.B7 | X3.A7 24.82,44.32 24.82,46.7 27.84,49.71 31.41,49.71 33.63,51.93 63,51.93 71.8,51.93 74.02,49.71 78.16,49.71 80.82,47.05 80.82,44.87
GND  (via drill 0.3, 0.35)
  Top 0.152: U2.63 42.03,27.43 v42.07,27.43 | R1.2
  Top 0.2: 23.27,41.73 X3.B1A12
  Top 0.203: C6.2 48.4,29.08 U2.12 | 49.5,34.9 49.49,34.9 U2.18 48.7,34.27 47.49,33.06 46.44,33.06 44,35.5 43.56,35.94 43.56,37.5 43.56,38.16 U2.31 44.44,38.86 45.34,39.77 45.97,39.77 C3.2 46.85,40.65 C1.2 | U2.47 35.1,35.3 35.1,36 | 35.1,36 C4.2 | U2.63 39.7,25.1 C2.2 | C8.2 65.35,25.15 v65.5,25 | v67.5,25 70.5,25 72,26.5 | LED1.2 2.55,22.92 3.13,22.34 3.13,21.45 2.55,20.88 LED2.2 2.55,19.92 3.13,19.34 3.13,18.45 2.55,17.88 LED3.2 2.55,16.92 3.13,16.34 3.13,15.45 2.55,14.88 LED4.2 2.55,13.92 3.13,13.34 3.13,12.45 2.55,11.88 LED5.2 2.55,10.92 3.13,10.34 3.13,9.45 2.55,8.88 LED6.2 2.55,7.92 3.13,7.35 3.13,6.46 2.55,5.88 LED7.2 | LED14.2 104.55,5.88 105.13,6.46 105.13,7.35 104.55,7.92 LED13.2 104.55,8.88 105.13,9.45 105.13,10.34 104.55,10.92 LED12.2 104.55,11.88 105.13,12.45 105.13,13.34 104.55,13.92 LED11.2 v104.55,14.88 105.13,15.45 105.13,16.34 104.55,16.92 LED10.2 104.55,17.88 105.13,18.45 105.13,19.34 104.55,19.92 LED9.2 104.55,20.88 105.13,21.45 105.13,22.34 104.55,22.92 LED8.2 | 26.9,38.6 25.4,38.6 24.5,39.5 24.5,40.21 R8.2 | 26.9,38.6 27.4,38.6 C14.2 29.32,40.52 29.32,41.28 | U1.3 29.01,41.79 29.32,41.47 29.32,41.28 | LED18.C 17,43.5 18.78,43.5 19.16,43.13 21.4,43.13 22.44,42.08 22.89,42.08 X3.B1A12 | v27.97,36.33 28.3,36 32.5,36 | 35.1,36 32.5,36 | 29.16,44.84 29.98,44.84 30.54,44.28 30.54,42.5 | 30.54,42.5 | 30.54,42.5 29.32,41.28 | 26.9,38.6 27.5,38 v27.5,37.5 | R14.2 47.5,12 47.5,12.13 46.97,12.66 46.97,14.75 47.11,14.88 47.92,14.88 R16.2 | v33.02,32.02 32.5,32.54 v32.5,33.5 32.5,36 | v53,33.5 52.38,34.12 51.88,34.12 51.5,34.5 | v72,34.5 71.62,34.5 70.84,35.28 69.85,35.28 66.92,38.2 57.1,38.2 v57,38.3 v57,41
  Top 0.203: 33.25,24.14 33.71,24.6 v33.73,24.6 | v37,39.5 33.54,39.5 31.77,41.27 30.54,42.5 | v67,30.87 67,30 | v73,30.87 73,30.27 | v84.9,22.4 83,20.5 | 84,19.5 v85.7,19.5 86.12,19.08 87.9,19.08 89.38,17.6 91.1,17.6 v92,18.5 | C12.- 67,14.25 71.75,14.25 C10.- | 81,40.12 79.3,40.12 79.2,40.02 78.8,40.02 78.24,40.58 72.42,40.58 v72,41
  Top 0.254: R3.1 74.72,51.5 74.72,50.63 74.59,50.5 | R9.1 31.27,50.63 31.41,50.5 | SW1.5 43.2,51.07 | SW1.4 34.8,51.07
  Top 0.305: v77,48.5 76.5,48.5 | 76.5,48.5 v74,48.5 73.93,48.57 73.82,48.57 71.32,51.07 63,51.07 | v29,50.5 31.41,50.5 31.5,50.5 33.25,52.25 | U5.5 56,10.07 v56,9.5 | v46.5,11.5 47,12 47.5,12 | v36.1,27.6 36.1,25.4 44,17.5 44,16.97 v46,14.97 | v37.23,27.91 37.23,25.5 44.86,17.86 44.86,17.67 v46.5,16.03 | 51.5,34.5 C5.2 49.5,34.9 | 49.5,34.9 | v46.51,9.51 46.38,9.64 44.09,9.64 42.84,10.89 42.84,17.04 35.28,24.6 v33.73,24.6 | 77.15,45.85 76.5,46.5 76.5,48.5 | 47,51.07 43.2,51.07 34.8,51.07 34.01,51.07 31.44,48.5 v29,48.5 29,47.79 29.38,47.41 29.38,46.72 29.15,46.48 R7.2 | 47,51.07 53,51.07 | 53,51.07 63,51.07 | v69,33.5 69,34.8 66.5,37.3 56.5,37.3 v56.41,37.21 | LED7.2 v6.6,5.1 8.6,5.1 v9,5.5 11.51,5.5 J11.2 | J13.P$4 33.36,18.2 U4.2 | IC2.2 25.47,32.44 25.81,32.44 25.98,32.6 25.98,33.44 25.81,33.6 25.3,33.6 R24.1 26.01,36.33 v27.97,36.33 | U2.12 47.8,29.77 47.35,30.22 47.35,30.45 48.86,31.97 v51.4,31.97 | R1.2 82.2,39.8 v85,39.8 | R20.1 76.83,35.4 76.42,34.99 75.45,34.99 73.96,33.5 72.96,34.5 v72,34.5 72,35.77 72.38,36.15 72.72,36.15 IC1.2 | LED14.2 103.92,4.47 101.78,4.47 101.27,3.97 96.47,3.97 v93,0.5 v83,0.5 v73,0.5 v63,0.5 v53,0.5 v43,0.5 v33,0.5 v23,0.5 v13,0.5 | 47,51.07 46.75,50.82 S1.2 47.13,49.47 47.13,45.63 v46,44.5 45,43.5 45,42.5 46.85,40.65 | C16.2 51.85,43.5 v51,43.5 | R31.2 36.5,47.2 34.8,48.9 SW1.4 | 33.25,52.25 33.36,52.36 43,52.36 | 43,52.36 53,52.36 | 53,52.36 63,52.36 | 63,52.36 72.08,52.36 73.94,50.5 v74,50.5 74.59,50.5 v77,50.5 77.16,50.5 77.84,51.18 77.84,52.07 78,52.23 80.94,52.23 82.67,50.5 v83,50.5 | X2.A1B12 82.76,41.33 82.73,41.3 82.73,41.02 R1.2 | 77.15,45.85 R2.2 76.65,44.76 76.61,44.73 76.61,44.49 81,40.12 81.23,40.12 81.26,40.15 R1.2
  Top 0.305: 77.15,45.85 77.83,45.85 X2.B1A12 | R8.2 23.27,41.73 | X3.A1B12 29.16,44.86 29.16,44.84 | v20,12.87 21.63,12.87 | J12.2 13.76,40.26 | 13.76,40.26 17,43.5 | v44,37.5 43.56,37.5 | v44,36 44,35.5 | R32.1 32.27,41.27 31.77,41.27 | v4,23.5 3.6,23.1 LED1.2 | v3,30.5 v13,40.5 13.52,40.5 13.76,40.26 | LED18.C 16.97,44.47 v23,50.5 | v33,52.5 33.25,52.25 | v43,52.5 43,52.36 | v63,52.5 63,52.36 | v53,52.5 53,52.36 | v53,50.5 53,51.07 | v63,50.5 63,51.07 | v73,52.5 74,51.5 74.72,51.5
  Top 0.406: 72.5,26 REG1.4 | 72.5,19 72.3,19.2 REG2.4 | v53,30 52.68,30.32 52.66,30.32 51.4,31.58 v51.4,31.97
  Top 0.508: J8.P$2 50.5,25.3 C6.2 | 33.25,24.14 v33.25,22.25 35.17,20.33 U4.2 | T1.2 74.04,33.5 73.96,33.5 | J1.P$1 v19.8,15.5 C15.-
  Top 0.813: C7.2 60.65,26.85 61.62,25.88 62.57,25.88 63.3,25.15 C8.2 | C11.2 70.45,20.05 71.3,19.2 REG2.4 | 72,26.5 72.5,26 | REG1.4 72,25 71.85,25.15 72,25.3 REG1.4
  Top 1.016: J8.P$2 50.5,19.5 52.5,17.5 57.7,17.5 C13.- | v85.16,10.66 85.47,10.66 86,11.18 86,17.5 84,19.5 83,20.5 80,23.5 78,23.5 76.67,24.83 76.67,29.35 75.75,30.27 73.96,30.27 73,30.27 68.25,30.27 67.97,30 67,30 v53,30 | C15.- v23.4,11.9 v24.5,10.8 25.51,9.79 J3.2
  Top 1.27: REG1.4 72,18.5
  Top 2.54: XT1.2 78.5,14.5 | 78.5,14.5 C9.- 76.3,19 72.5,19 | C10.- 78.2,14.2 78.5,14.5
  Bottom 0.203: v65.5,25 v67.5,25 67.5,30.87 | v27.97,36.33 27.5,36.8 v27.5,37.5 | 72,32.7 77.19,32.7 | 72,32.7 69,32.7 | 69,32.7 53.8,32.7 v53,33.5 | 69,32.7 v69,33.5 | 72,32.7 v72,34.5 | v57,38.3 57,37.8 v56.41,37.21 | v37,39.5 36.92,39.5 26.82,29.39 26.82,18.64 23.68,15.5 v19.8,15.5 | 90,18.74 90,17.56 87.42,17.56 87.36,17.5 | 77.19,32.7 80.8,32.7 v81,32.5 | v92,18.5 91.39,18.5 77.19,32.7 | v57,41 v57,42 v69,42 v69,41 | v33.25,22.25 33.36,22.25 33.46,22.14 | v29.5,22.1 29.1,22.5 | v38,32.5 36.68,32.5 35.2,33.98 34.8,33.98 34.52,33.7 34.52,33.52 v33.02,32.02 | v86.16,16.66 86.16,19.05 v85.7,19.5 | v86.16,12.66 86.16,10.66 86,10.5
  Bottom 0.305: v56,9.5 57.01,8.49 J6.2 | J5.2 v46.51,9.5 | v46.51,9.51 v46.51,11.49 v46.5,11.5 | v35.91,29.13 37.13,27.91 | 37.13,27.91 v37.23,27.91 | v46,14.97 46,15.53 v46.5,16.03 50.47,20 J8.P$2 | 23,4 9.5,4 9,4.5 v9,5.5 | 23,4 25.02,4 25.52,4.5 | v36.1,27.6 36.41,27.91 37.13,27.91 | v77,48.5 v77,50.5 | v29,48.5 v29,50.5 | v74,50.5 v74,48.5 | v33.02,32.02 29,28 29,22.6 | v32.5,33.5 27.9,28.9 27.9,18.29 22.48,12.87 v20,12.87 | v51.4,31.97 53.28,31.97 53.36,31.89 76.85,31.89 90,18.74 | v85,39.8 87.7,39.8 90,37.5 | 90,37.5 90.46,37.04 J10.2 90.46,31.96 v90,31.5 91,30.5 v93,30.5 v93,29.5 v96,29.5 97,30.5 v103,30.5 | v51,43.5 47,43.5 v46,44.5 | 29,22.6 29.1,22.5 | 29,22.6 29,17.88 23.4,12.28 v23.4,11.9 | v23,0.5 23,4 | 63,4.5 v63,0.5 | v38,32.5 v40,30.5 40,31.5 v41,32.5 40,33.5 v40,35.5 | v43.6,39.8 44,39.4 v44,37.5 | v4,23.5 4.08,23.5 4.18,23.6 4.18,29.32 v3,30.5 | v93,40.5 90,37.5 | v81,32.5 v84,32.5 | J2.P$1 103.93,15.5 v104.55,14.88
  Bottom 0.406: v46.51,9.5 v46.51,9.51 | v36.1,27.6 36.1,26.97 v33.73,24.6
  Bottom 0.508: v33.73,24.6 31.63,22.5 29.1,22.5 | 33.46,22.14 34.5,23.19 35.62,23.19 40.57,28.13 41.37,28.13 v42.07,27.43 35.17,20.53 U4.2 U4.7 35.17,7.34 J4.2 | X1.P$13 72.54,48.5 v74,48.5 | v85.16,10.66 85.31,10.5 86,10.5 87.36,11.86 87.36,17.5 87.36,17.86 87.34,17.86 v85.7,19.5
  Bottom 0.61: 85.71,19.5 v85.7,19.5 85.7,21.6 v84.9,22.4 76.43,30.87 v73,30.87 67.5,30.87 v67,30.87 v60,30.87 53.87,30.87 53.43,30.43 53.43,30.26 53.12,29.95
  Bottom 2: J3.2 25.51,4.51 | 25.51,4.51 25.5,4.5 | J4.2 36.01,4.51 | 36.01,4.51 36,4.5 25.52,4.5 25.51,4.51 | 36.01,4.51 36.02,4.5 46.5,4.5 | 46.5,4.5 46.51,4.51 J5.2 | 46.5,4.5 57,4.5 | 57,4.5 57.01,4.51 J6.2 | 57,4.5 63,4.5 67.5,4.5 67.51,4.51 | 67.51,4.51 J7.2 | 67.51,4.51 71.49,4.51 71.5,4.5 74,7 74,10.5 76.5,13 XT1.2
  other vias: 21,29 19,30.5 20.7,33.5 25,30.1 25.4,27.8 31.9,29.7 32.6,37.6 33.6,39.1 39.2,40.1 41,41.5 48.1,38.5 49.1,41.5 77.5,38.5 85.5,30.5 93.5,23.5 98.5,23.5
  pour Top: -2,-2.5 -2,30 23,55 83,55 108,30 108,-2.5
  pour Bottom: -2,-2.5 -2,30 23,55 83,55 108,30 108,-2.5
LCELL-L
  Top 0.305: R21.1 73.09,38.25 IC1.1
LCELL-R
  Top 0.305: R25.1 24.29,30.31 IC2.1
LED-FLOOR  (via drill 0.35)
  Top 0.305: U2.36 39.33,38.86 39.33,38.92 37.75,40.5 v36,40.5
  Top 0.508: J11.4 5.76,8.24 5.76,24.76 v9.62,28.61
  Bottom 0.305: v36,40.5 23.16,40.5 22.78,40.12 18.76,40.12 9.62,30.98 v9.62,28.61
LED-L  (via drill 0.35)
  Top 0.152: v27,31.5 27.83,31.5 JP1.1
  Top 0.203: v26.3,27.8 29.9,27.8 v30.2,28.1 | v34,28.5 36.14,30.64 U2.50
  Top 0.254: T2.2 28.57,31.13 | 28.57,31.13 28.2,31.13 JP1.1 | R27.2 28.56,31.12 28.57,31.13
  Bottom 0.152: v26.3,27.8 26.3,29.16 26.45,29.31 26.45,30.95 v27,31.5
  Bottom 0.203: v30.2,28.1 33.6,28.1 v34,28.5
LED-L-5V  (via drill 0.35)
  Top 0.254: R26.2 31.1,31.58 T2.1 28.84,32.09 JP1.2
  Top 0.305: v4.74,25.52 3.17,25.52 LED1.3 | R26.2 30.68,29.11 30.68,29.06 30.52,28.9 29.44,28.9 29,28.46 20.38,28.46 v16.17,24.25
  Bottom 0.305: v16.17,24.25 6.01,24.25 v4.74,25.52
LED-R  (via drill 0.3)
  Top 0.203: v40,39.5 40.5,39 U2.34
  Top 0.305: T3.2 80.14,35.56 JP2.1 79.55,36.15 79.35,36.15 79,36.5 v79,37.5 79,38 R29.2
  Bottom 0.203: v79,37.5 77,37.5 71.86,42.64 53.86,42.64 51.52,44.98 45.48,44.98 v40,39.5
LED-R-5V
  Top 0.305: JP2.2 80.2,37.3 81,36.5 83.99,36.5 T3.1 84.49,37 R28.2 85.75,37 85.78,37.03 87.07,37.03 91.83,32.27 92.65,32.27 93.3,32.92 94.59,32.92 101.69,25.82 103.63,25.82 LED8.3
LED-TOP  (via drill 0.35)
  Top 0.305: U2.9 47.38,27.98 47.38,27.25 49,25.62 v49,24.5 | J8.P$5 55.5,22.5 v52,22.5
  Bottom 0.305: v49,24.5 51,22.5 v52,22.5
LED-UI  (via drill 0.3)
  Top 0.203: U2.35 40.38,38.42 40.9,37.9 40.9,36.6 v41,36.5 | v45,32.5 72,32.5 v73,33.5
  Bottom 0.203: v45,32.5 v41,36.5 | v73,33.5 73.1,33.6 83.9,33.6 88.94,28.56 88.94,22.24 92.48,18.7 92.48,10.03 J9.2
LED-WHITE
  Top 0.305: U2.33 37.8,42.5 LED17.A
N$1
  Top 0.203: LED1.1 1.45,23 LED2.3
N$2
  Top 0.203: LED2.1 1.45,20 LED3.3
N$3
  Top 0.203: LED3.1 1.45,17 LED4.3
N$4
  Top 0.254: LED4.1 2.55,13 LED5.3
N$5
  Top 0.254: LED6.3 1.45,11 LED5.1
N$6
  Top 0.254: LED7.3 1.45,8 LED6.1
N$7
  Top 0.203: LED8.1 104.55,22 LED9.3
N$8
  Top 0.203: U1.10 32.49,39.71 32.18,40.03 31.23,40.03 C14.1
N$9
  Top 0.203: LED9.1 104.55,19 LED10.3
N$10
  Top 0.203: LED10.1 104.55,16 LED11.3
N$11
  Top 0.203: LED11.1 104.55,13 LED12.3
N$12
  Top 0.203: LED13.3 103.45,11 LED12.1
N$13
  Top 0.203: LED13.1 103.45,8 LED14.3
N$14
  Top 0.305: R1.1 81.15,41.1 80.67,41.58 80.67,42.4 X2.A5
N$15
  Top 0.305: X2.B5 78.73,44.7 78.73,44.48 78.42,44.17 77.98,44.17 77.5,44.65 R2.1
N$16
  Top 0.254: LED15.C R3.2
N$17
  Top 0.508: 79,31.46 75.05,31.46 T1.1
  Top 0.61: LS1.2 84.96,31.46 79,31.46
N$18
  Top 0.203: U2.30 45.24,39.13 45.8,39.13 46,38.93 46.23,38.93 48.57,41.27 48.57,41.46 47.66,42.37 46.63,42.37 C1.1
N$19  (via drill 0.35)
  Top 0.305: R18.1 77.2,36.45 77.78,35.87 77.78,35.82 R20.2 77.9,35.1 v77.9,34.5 | IC1.3 73.09,35.31 v73.9,34.5
  Bottom 0.305: v73.9,34.5 v77.9,34.5
N$20
  Top 0.305: IC1.4 76.62,36.48 76.62,36.97 77.2,37.55 R19.1 76.87,37.6 76.42,38.05 75.91,38.05 R21.2
N$21
  Top 0.203: R19.2 78.25,37.75 78.22,37.78
  Top 0.305: J10.3 92.24,34.66 87.77,39.13 78.68,39.13 78.22,38.67 78.22,37.78
N$22
  Top 0.203: U1.6 29.92,36.93 23.57,36.93 R10.2
N$23
  Top 0.203: LED18.A R10.1
N$24
  Top 0.305: R18.2 78.2,36.45 78.78,35.87 78.78,35.22 79.11,34.89 87.62,34.89 91.09,31.41 93.91,31.41 J10.4
N$25
  Top 0.305: 23.29,33.51 23.2,33.6 21.77,33.6 20.98,32.81 R22.1 | IC2.3 23.78,33.02 23.29,33.51 | R24.2 23.29,33.51
N$26
  Top 0.305: R25.2 23.29,30.63 23.36,30.7 23.36,32.14 | 23.36,32.14 IC2.4 | R23.1 21.57,31.12 21.57,31.5 22.21,32.14 23.36,32.14
N$27
  Top 0.2: Q1.1 44.85,12.5 44.58,12.5 44.27,12.19 44.27,10.61 44.41,10.47 47.27,10.47 R17.1
N$28
  Top 0.203: 47.5,13.68 54.93,13.68 U5.7
  Top 0.305: R15.2 47.5,13.68 R16.1
N$29
  Top 0.305: R22.2 19.98,34.12 J12.4
N$30
  Top 0.305: J12.3 19.98,30.6 R23.2
N$31
  Top 0.508: X1.P$14 73.19,46.55 D3.K
N$32
  Top 0.305: R32.2 LED17.C
N$47
  Top 0.305: R7.1 29.26,44.15 29.08,43.97 27.3,43.97 X3.A5
N$48
  Top 0.305: R8.1 25.35,40.24 25.39,40.27 25.39,41.64 X3.B5
N$49  (via drill 0.35)
  Top 0.203: X2.B4A9 78.2,45.09 v78.2,44.7 | v81.2,41.8 81.69,41.8 X2.A4B9
  Top 0.254: X2.A4B9 82.19,42.66 82.49,42.96 82.49,46.2 78.52,50.17 LED15.A
  Bottom 0.203: v78.2,44.7 81.1,41.8 v81.2,41.8
N$50  (via drill 0.35)
  Top 0.203: X3.A4B9 28,44.89 v28,44.5 | v24.7,41.4 X3.B4A9
  Top 0.254: X3.B4A9 23.81,42.66 23.51,42.96 23.51,46.2 27.48,50.17 LED16.A
  Bottom 0.203: v28,44.5 27.32,44.5 24.7,41.88 v24.7,41.4
N$51
  Top 0.254: R9.2 LED16.C
NRST  (via drill 0.35)
  Top 0.305: J13.P$3 23.72,22.42 23.72,23.61 22.83,24.5 21.07,24.5 20.28,25.29 20.28,26.11 20.87,26.7 30.6,26.7 35.8,31.9 42.04,31.9 43,30.94 | 43,30.94 U2.7 | R30.2 50.42,42.58 50.97,42.58 51.9,41.65 C16.1 | R30.2 50,48.58 S1.1 | R30.2 49.5,43 v49,42.5 | v43,37.5 43,30.94
  Bottom 0.305: v49,42.5 45,42.5 43,40.5 v43,37.5
SCL  (via drill 0.35)
  Top 0.305: U2.61 39.37,26.19 38.64,26.19 38.03,26.8 v38,26.8 | U4.4 29.49,20.01 R13.2
  Bottom 0.508: U4.4 30.12,20.01 34.02,23.9 35.1,23.9 v38,26.8
SDA  (via drill 0.35)
  Top 0.305: U2.62 41.03,27.14 41.03,27.47 v41,27.5 | R12.2 28.54,24.1 U4.3
  Bottom 0.508: v41,27.5 35.95,22.45 35.11,22.45 32.66,20.01 U4.3
SERVO-SIG
  Top 1.016: U5.6 53.37,11.86 53,11.5 53,8.5
  Top 1.27: J3.1 28,8.5 38.5,8.5 | 38.5,8.5 J4.1 | 38.5,8.5 49.5,8.5 | J5.1 49,8 49.5,8.5 | J6.1 57.5,8.5 56.43,8.5 56.42,8.49 55.58,8.49 55.57,8.5 53,8.5 49.5,8.5
  Bottom 1.016: J7.1 68,8.5 61.5,8.5 J6.1
SIG-FLOOR  (via drill 0.3, 0.35)
  Top 0.203: v43.75,34.5 43.75,31 46.25,28.5 U2.8
  Top 0.508: v11,28.5 6.4,23.9 6.4,10.1 J11.3 12.23,8.73 19.16,8.73 19.7,8.19 R11.2
  Bottom 0.203: v43.75,34.5 38.25,40 23.2,40 22.94,39.74 18.91,39.74 10.77,31.59 10.77,28.73 v11,28.5
SPK  (via drill 0.35)
  Top 0.203: 75.67,33.2 T1.3 74.63,32.16 60.61,32.16 59.35,30.9 v52.9,30.9 | v40.05,28.9 39.05,27.9 U2.58
  Bottom 0.203: v52.9,30.9 52.9,30.58 52.52,30.2 52.52,29.34 48.48,25.3 42.8,25.3 42.52,25.58 42.52,27.2 42.55,27.23 42.55,27.63 41.56,28.62 40.78,28.62 40.5,28.9 v40.05,28.9
SW1  (via drill 0.3, 0.35)
  Top 0.203: v47.5,34.25 48,34.75 U2.20 | J9.4 91.01,10.95 94.45,14.39 94.45,23.55 v89.75,28.25 R5.2
  Bottom 0.203: v47.5,34.25 46.75,34.25 44,37 42.82,37 42.52,37.3 42.52,40.56 44.94,42.98 52.27,42.98 55,40.25 70.95,40.25 73,38.2 73,38.03 76.03,35 83.43,35 89.75,28.68 v89.75,28.25
SW2  (via drill 0.3, 0.35)
  Top 0.203: v45.5,34.75 47.25,34.75 47.75,35.25 U2.21 | v72.8,40.1 71.1,40.1 71.09,40.1 65.4,40.1 v62,43.5 | v42,40.5 v42,42.5 | R6.2 89.27,28.73 89.27,28.05 v90.46,26.86 | v94.12,13.38 94.12,7.12 J9.3
  Bottom 0.203: v45.5,34.75 44.25,34.75 42,37 v42,40.5 | v62,43.5 57.54,43.5 55.73,45.31 44.81,45.31 v42,42.5 | v72.8,40.1 75,37.9 75,36.82 76.49,35.33 84.85,35.33 92,28.18 92,27.5 91.36,26.86 v90.46,26.86 93.34,23.98 93.7,23.98 94.45,23.23 94.45,13.71 v94.12,13.38
SWCLK
  Top 0.305: U2.49 30.4,25.7 J13.P$1
SWDIO
  Top 0.305: U2.46 36.49,34.52 36.95,34.07 36.95,33.84 30.34,27.23 20.79,27.23 19.85,26.29 19.85,25.11 21.76,23.2 J13.P$2
TOGGLE  (via drill 0.3, 0.35)  (1 unrouted)
  Top 0.203: v48.25,36.25 48,36.25 47.5,35.75 U2.22 | v49.25,33 51.75,33 v52.25,33.5 | J9.1 98.5,13.44 99.45,14.39 99.45,23.53 93.98,29 93,29 | R4.2 92.5,29 v91.2,27.7
  Bottom 0.203: v48.25,36.25 48.25,34 v49.25,33 | v91.2,27.7 89.62,27.7 89.27,28.05 89.27,28.7 83.97,34 73.5,34 72.48,35.02 53.77,35.02 v52.25,33.5
UART1-RX
  Top 0.203: U2.43 36.13,37.1 33.9,37.1 U1.8
UART1-TX
  Top 0.203: U2.42 35.94,38 33.71,38 U1.9
UART2-RX  (via drill 0.35)
  Top 0.305: U2.17 49.3,34 v50.5,34
  Bottom 0.305: v50.5,34 50.9,34 52.35,32.55 53.31,32.55 53.54,32.32 77.03,32.32 91,18.35 J2.P$4
UART2-TX  (via drill 0.35)
  Top 0.305: U2.16 49.3,31 v50.5,31 | v87.7,18.6 88.4,17.9 88.79,17.51 89.08,17.22 91.41,17.22 93.13,15.5 J2.P$3
  Bottom 0.305: v87.7,18.6 86.37,19.93 86.37,21.75 76.67,31.45 51.85,31.45 51.4,31 v50.5,31
UART3-RX
  Top 0.305: X1.P$7 54.76,34.5 52.6,34.5 49.9,37.2 46.84,37.2 U2.25
UART3-TX
  Top 0.305: U2.29 45.07,38.16 45.53,38.61 45.76,38.61 46.61,37.77 66.73,37.77 X1.P$8
UART4-RX  (via drill 0.35)
  Top 0.305: v54.3,26.58 v54.3,26.59 50.83,30.05 49.5,30.05 48.86,30.69 U2.15
  Bottom 0.305: v54.3,26.58 55.5,25.38 J8.P$4
UART4-TX  (via drill 0.35)
  Top 0.305: v53,25.78 53,26.38 49.75,29.62 49.27,29.62 U2.14
  Bottom 0.305: v53,25.78 J8.P$3
UART5-RX
  Top 0.305: U5.1 49.44,14.41 48.34,15.5 46.28,15.5 44.43,17.35 44.43,17.68 36.7,25.42 36.7,28.46 U2.54
UART5-TX
  Top 0.203: R17.2 50.42,10.7 50.5,10.75 U5.4
  Top 0.305: R17.2 48.08,10.28 48.08,10.23 47.92,10.07 44.27,10.07 43.27,11.07 43.27,17.59 35.57,25.29 35.57,28.04 U2.53
UART6-RX  (via drill 0.35)
  Top 0.305: v37.06,37.56 38.19,37.56 38.53,37.91 38.86,37.91 U2.38
  Bottom 0.508: v37.06,37.56 33.13,33.63 33.13,33.24 28.43,28.54 28.43,18.06 22.61,12.24 10.76,12.24 J1.P$4
UART6-TX  (via drill 0.35)
  Top 0.305: v37,38.5 38.98,38.5 U2.37
  Bottom 0.508: v37,38.5 32.63,34.13 32.24,34.13 27.37,29.26 27.37,18.51 22.54,13.68 11.82,13.68 J1.P$3
VDD
  Top 0.406: D2.K 64.47,21.25 REG2.1 | 62.23,28.28 D1.K
  Top 0.813: REG1.1 62.23,28.28 | D2.K 62.23,21.48 REG2.1 66.28,23.07 66.28,27.99 | C8.1 64.5,28.08 REG1.1 | C9.+ 75.63,24.07 75.63,28.92 75.32,29.23 68.68,29.23 67.44,27.99 66.28,27.99 | 66.28,27.99 64.99,27.99 REG1.1
  Top 1.016: J8.P$1 48,19.5 51.5,16 56.75,16 59,13.75 59,11 60.2,9.8 C13.+ | C15.+ 23,7.9 J3.3
  Top 2: J3.3 23,4.5 33.5,4.5 | 33.5,4.5 J4.3 | 33.5,4.5 44,4.5 | 44,4.5 J5.3 | 44,4.5 54.5,4.5 | 54.5,4.5 J6.3 | 54.5,4.5 65,4.5 | 65,4.5 J7.3 | 65,4.5 71.5,4.5 74,7 74,8.8 C10.+
  Top 2.54: C9.+ 83.5,16.2 XT1.1 83.7,12.8 80.7,9.8 C10.+ C12.+ C13.+

### Text on the board
tPlace: +
Compartment: USB-R | USB-L | SWD-DEBUG | BOOT0 | RST | 5V | ESP32C3 | 3V3 | UART-USB | GYRO | ATMEGA-USB | ATMEGA | CPU | REG | TOUCH | FLOOR | BUZZER | RS485 | CAMERA | MOTOR CONNECTOR | CAMERA | 7.4V